# EAGLE design Dashboard r3 (EAGLE 7.7.0)
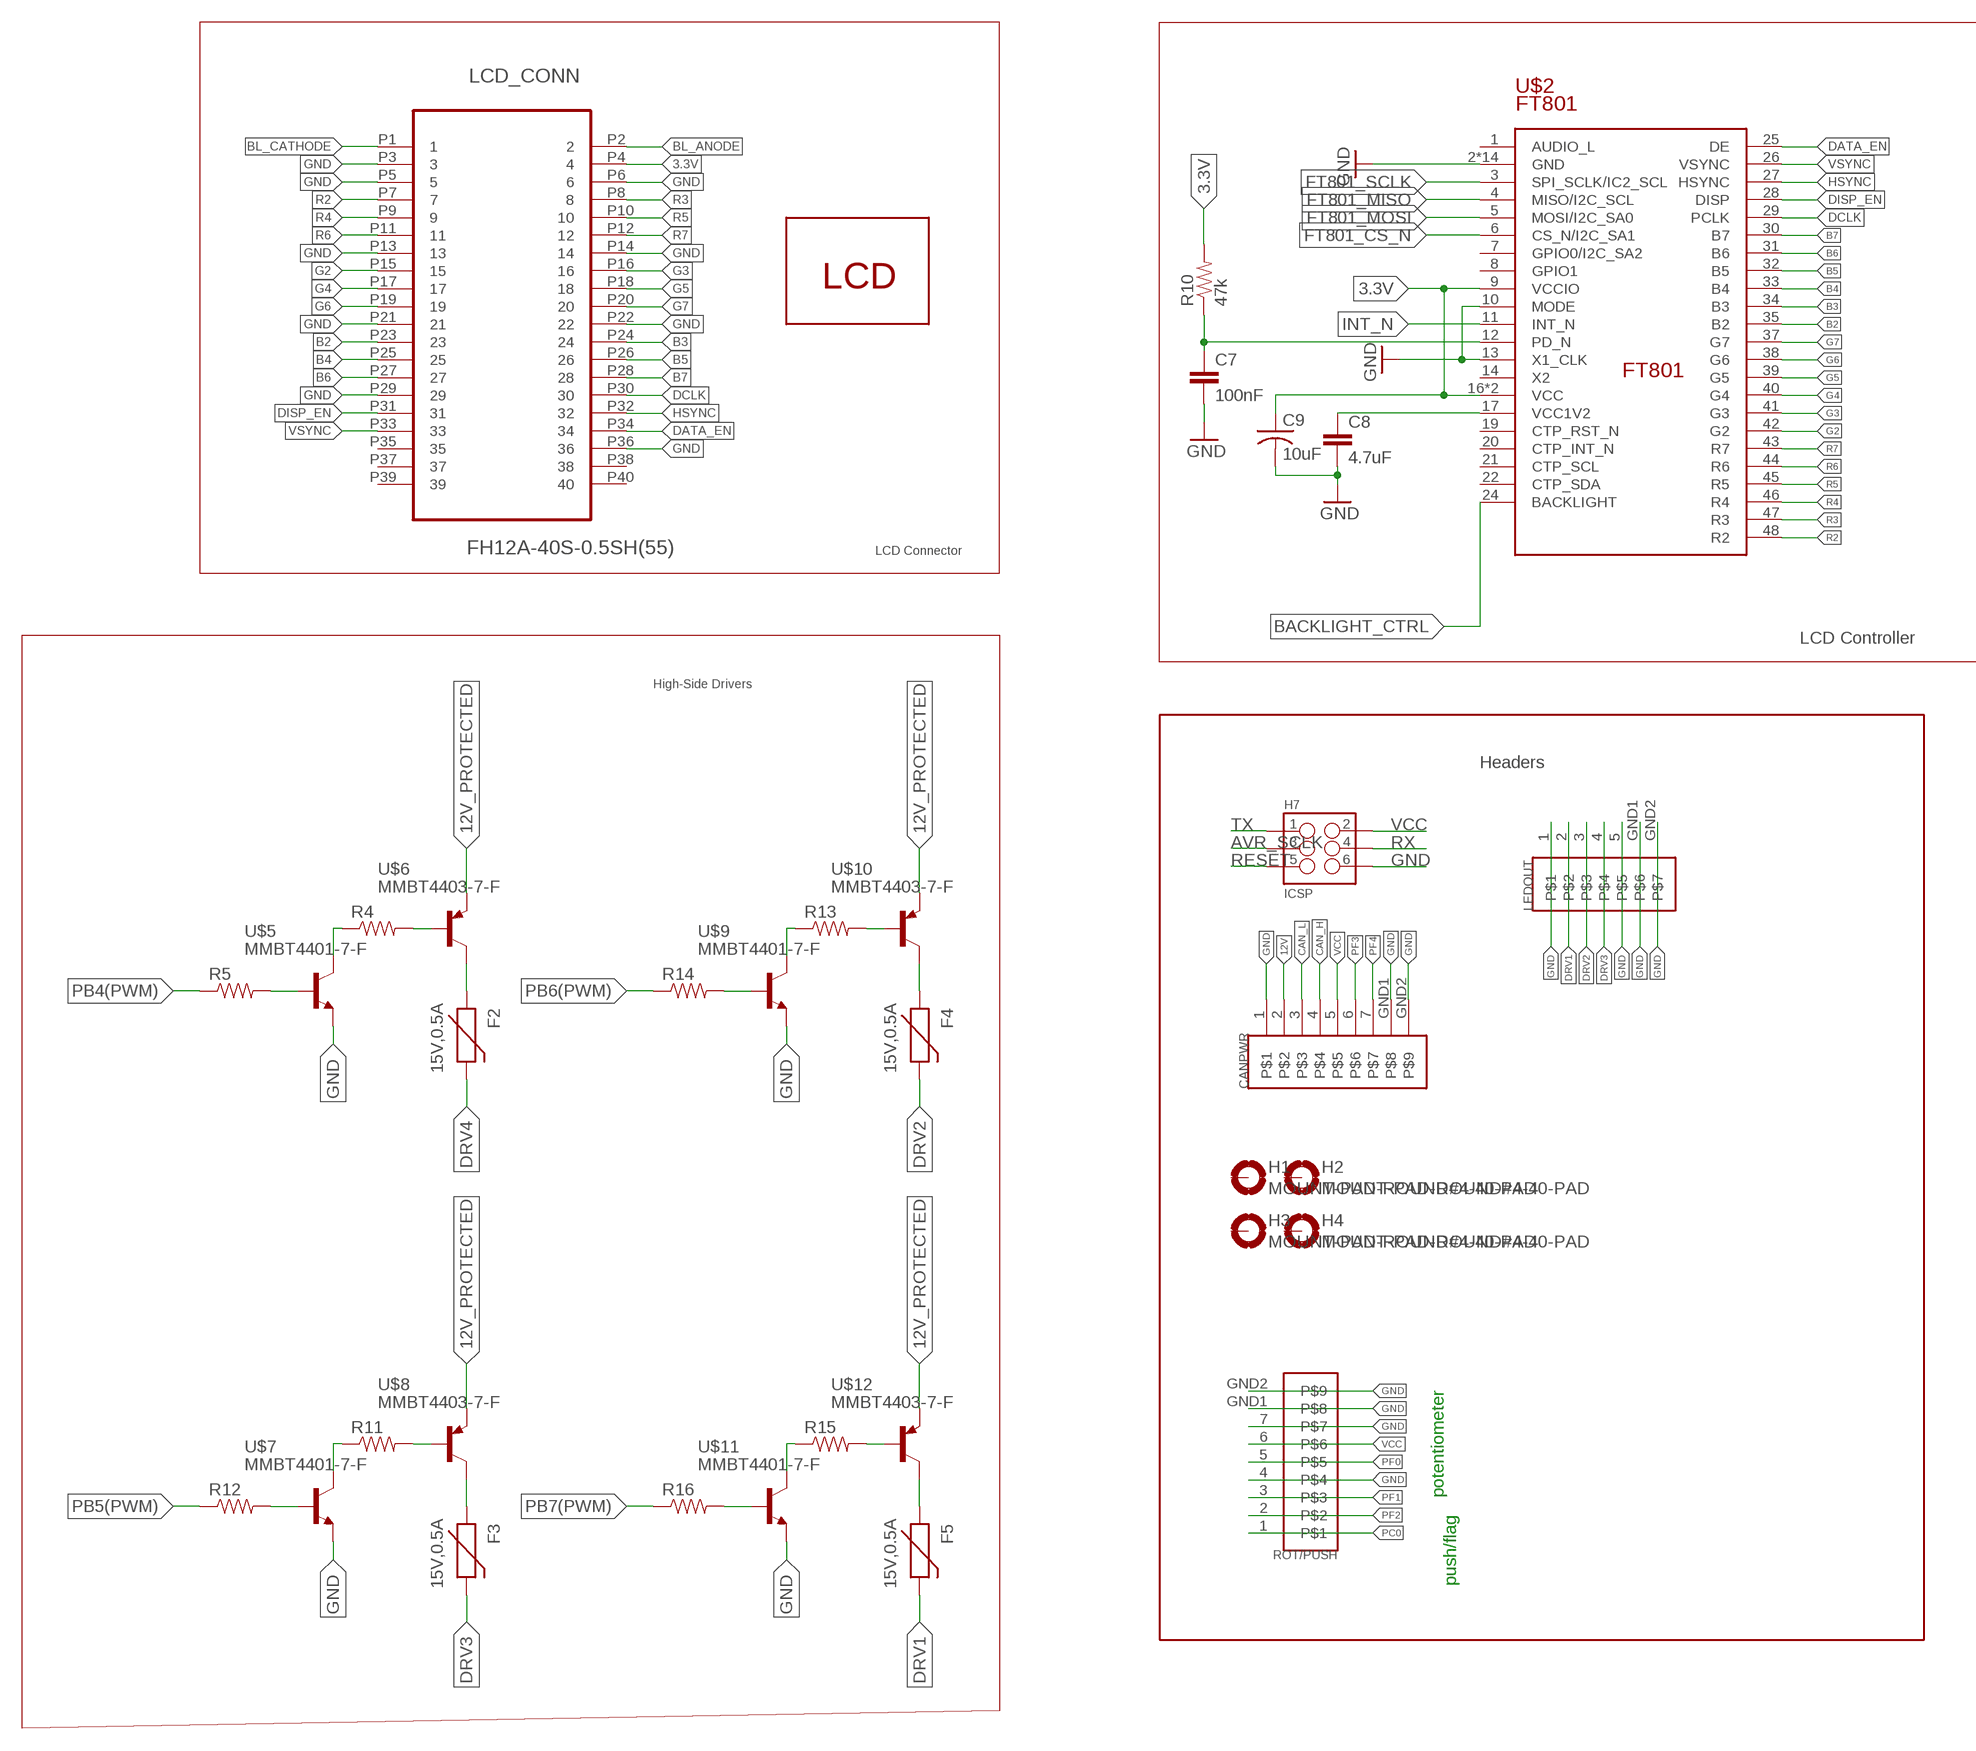
[diagram p0: schematic, sheet 1, part 1 of 2]
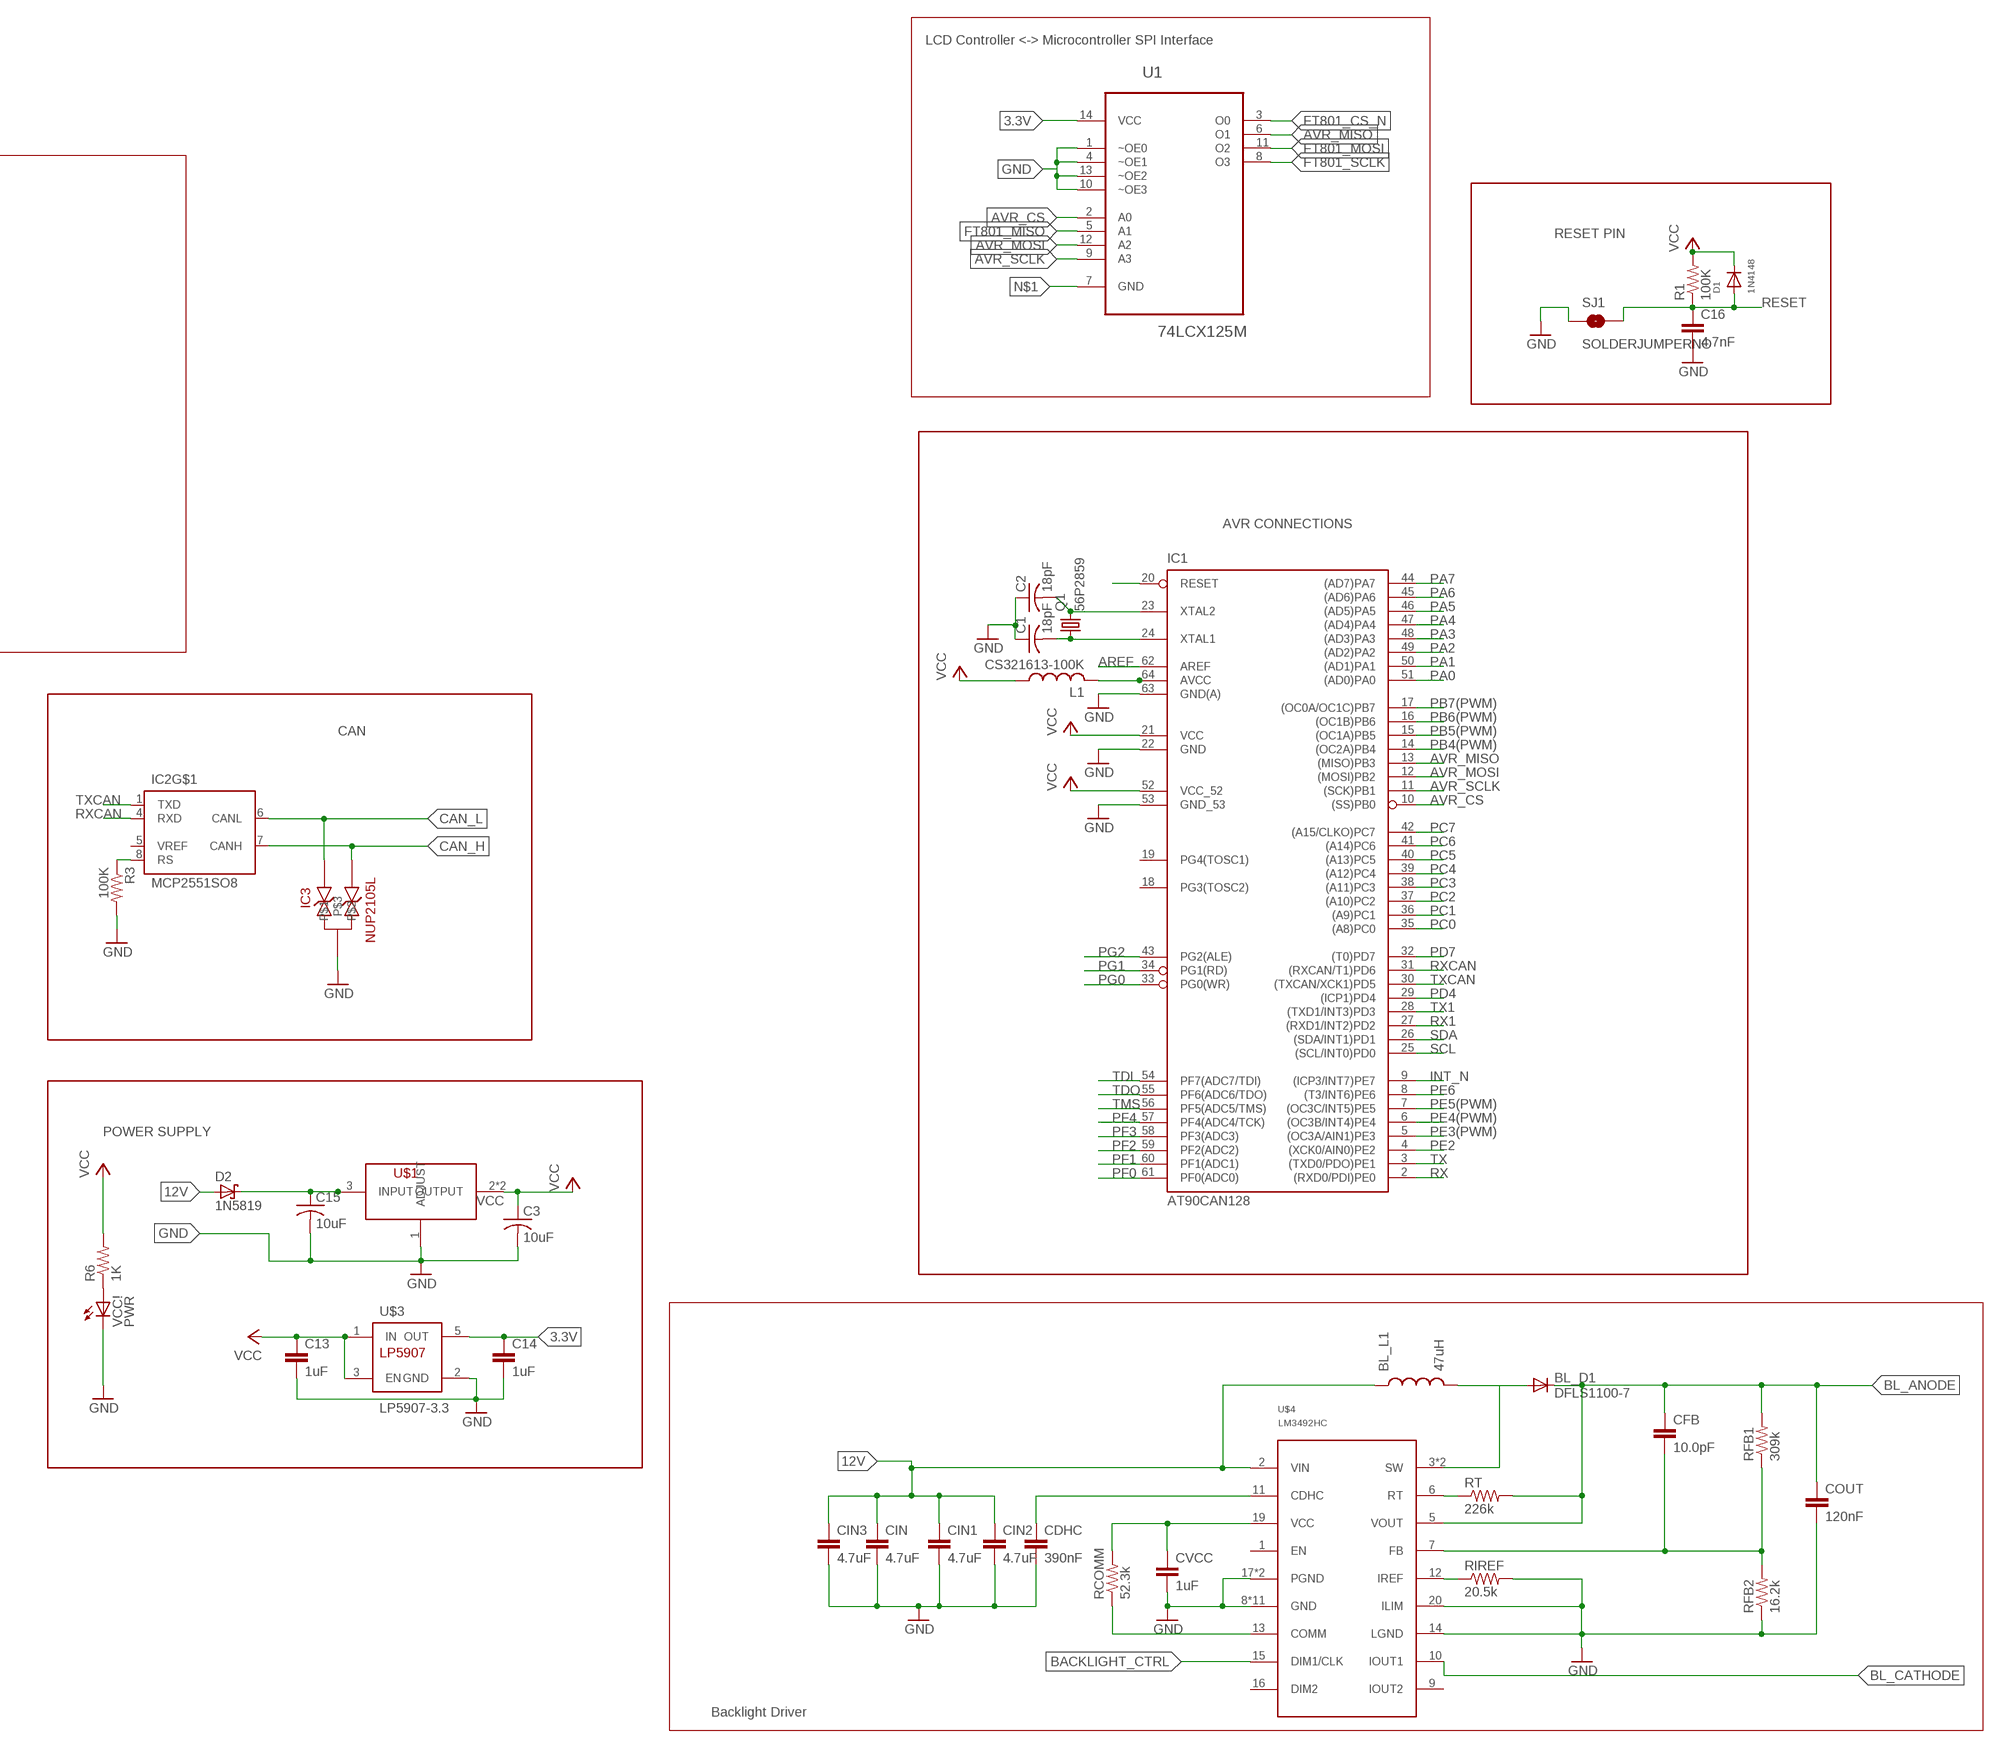
[diagram p1: schematic, sheet 1, part 2 of 2]

## Parts
BL_D1  DFLS1100-7  [POWERDI-123]
BL_L1  47uH  LTF4022-D  [2-SMD]
C1  18pF  C-USC0805  [C0805]
C2  18pF  C-USC0805  [C0805]
C3  10uF  C-USC2220  [C2220]
C7  100nF  CAP0603-CAP  [0603-CAP]
C8  4.7uF  CAP0805  [0805]
C9  10uF  C-USC2220  [C2220]
C13  1uF  CAP0603-CAP  [0603-CAP]
C14  1uF  CAP0603-CAP  [0603-CAP]
C15  10uF  C-USC2220  [C2220]
C16  4.7nF  CAP0805  [0805]
CANPWR  53261-0771  [53261-0771]
CDHC  390nF  CAP0603-CAP  [0603-CAP]
CFB  10.0pF  CAP0603-CAP  [0603-CAP]
CIN  4.7uF  CAP0805  [0805]
CIN1  4.7uF  CAP0805  [0805]
CIN2  4.7uF  CAP0805  [0805]
CIN3  4.7uF  CAP0805  [0805]
COUT  120nF  CAP0805  [0805]
CVCC  1uF  CAP0603-CAP  [0603-CAP]
D1  1N4148  DIODESOD-123  [SOD-123]
D2  1N5819  1N5819-BSOD123  [SOD123]
F2  15V,0.5A  PTCSMD  [PTC-1206]
F3  15V,0.5A  PTCSMD  [PTC-1206]
F4  15V,0.5A  PTCSMD  [PTC-1206]
F5  15V,0.5A  PTCSMD  [PTC-1206]
H1  MOUNT-PAD-ROUND#4-40-PAD  [#4-40-PAD-ROUND]
H2  MOUNT-PAD-ROUND#4-40-PAD  [#4-40-PAD-ROUND]
H3  MOUNT-PAD-ROUND#4-40-PAD  [#4-40-PAD-ROUND]
H4  MOUNT-PAD-ROUND#4-40-PAD  [#4-40-PAD-ROUND]
H7  ICSP  M03X2SMD_FCI  [2X3_SMD_FCI_54202-G30]
IC1  AT90CAN128  [TQFP64]
IC2  MCP2551SO8  [SO08]
IC3  NUP2105L  [SOT-23]
L1  CS321613-100K  L-USL3216C  [L3216C]
LCD_CONN  FH12A-40S-0.5SH(55)  [HIROSE_FH12A-40S-0.5SH(55)]
LEDOUT  53261-0571  [53261-0571]
Q1  56P2859  CRYSTALSMD  [HC49UP]
R1  100K  R-US_R0805  [R0805]
R3  100K  R-US_R0805  [R0805]
R4  RESISTOR0603  [0603-RES]
R5  RESISTOR0603  [0603-RES]
R6  1K  R-US_R0805  [R0805]
R10  47k  RESISTOR0603  [0603-RES]
R11  RESISTOR0603  [0603-RES]
R12  RESISTOR0603  [0603-RES]
R13  RESISTOR0603  [0603-RES]
R14  RESISTOR0603  [0603-RES]
R15  RESISTOR0603  [0603-RES]
R16  RESISTOR0603  [0603-RES]
RCOMM  52.3k  RESISTOR0603  [0603-RES]
RFB1  309k  RESISTOR0603-RES  [0603-RES]
RFB2  16.2k  RESISTOR0603-RES  [0603-RES]
RIREF  20.5k  RESISTOR0603-RES  [0603-RES]
ROT/PUSH  53261-0771  [53261-0771]
RT  226k  RESISTOR0603-RES  [0603-RES]
SJ1  SOLDERJUMPERNO  [SJ_2S-NO]
U1  74LCX125M  [SOIC127P600X175-14N]
U$1  NCP1117  [SOT-223-4]
U$2  FT801  [RGZ48_5P15X5P15]
U$3  LP5907-3.3  LP5907  [SOT23-DBV]
U$4  LM3492HC  [PWP0020A]
U$5  MMBT4401-7-F  [SOT-23-3]
U$6  MMBT4403-7-F  [SOT-23-3]
U$7  MMBT4401-7-F  [SOT-23-3]
U$8  MMBT4403-7-F  [SOT-23-3]
U$9  MMBT4401-7-F  [SOT-23-3]
U$10  MMBT4403-7-F  [SOT-23-3]
U$11  MMBT4401-7-F  [SOT-23-3]
U$12  MMBT4403-7-F  [SOT-23-3]
U$13  TCG043WQLBAANN-GN00  [TCG043WQLBAANN]
VCC!  PWR  LEDCHIPLED_0805  [CHIPLED_0805]

## Nets
3.3V: C9.1 C14.1 LCD_CONN.P4 R10.2 U1.14(VCC) U$2.9(VCCIO) U$2.16(VCC) U$2.18(VCC) U$3.5(OUT)
12V: BL_L1.1 CANPWR.2 CIN1.1 CIN2.1 CIN3.1 CIN.1 D2.A U$4.2(VIN)
12V_PROTECTED [Class3]: C15.1 D2.C U$1.3(INPUT) U$6.P$3(E) U$8.P$3(E) U$10.P$3(E) U$12.P$3(E)
AREF: IC1.62(AREF)
AVR_CS: IC1.10((SS)PB0) U1.2(A0)
AVR_MISO: IC1.13((MISO)PB3) U1.6(O1)
AVR_MOSI: IC1.12((MOSI)PB2) U1.12(A2)
AVR_SCLK: H7.3 IC1.11((SCK)PB1) U1.9(A3)
B2: LCD_CONN.P23 U$2.35(B2)
B3: LCD_CONN.P24 U$2.34(B3)
B4: LCD_CONN.P25 U$2.33(B4)
B5: LCD_CONN.P26 U$2.32(B5)
B6: LCD_CONN.P27 U$2.31(B6)
B7: LCD_CONN.P28 U$2.30(B7)
BACKLIGHT_CTRL: U$2.24(BACKLIGHT) U$4.15(DIM1/CLK)
BL_ANODE: BL_D1.C CFB.1 COUT.1 LCD_CONN.P2 RFB1.2 RT.2 U$4.5(VOUT)
BL_CATHODE: LCD_CONN.P1 U$4.10(IOUT1)
CAN_H: CANPWR.4 IC2.7(CANH) IC3.2
CAN_L: CANPWR.3 IC2.6(CANL) IC3.1
DATA_EN: LCD_CONN.P34 U$2.25(DE)
DCLK: LCD_CONN.P30 U$2.29(PCLK)
DISP_EN: LCD_CONN.P31 U$2.28(DISP)
DRV1: F5.2 LEDOUT.2
DRV2: F4.2 LEDOUT.3
DRV3: F3.2 LEDOUT.4
DRV4 [Class3]: F2.2
FT801_CS_N: U1.3(O0) U$2.6(CS_N/I2C_SA1)
FT801_MISO: U1.5(A1) U$2.4(MISO/I2C_SCL)
FT801_MOSI: U1.11(O2) U$2.5(MOSI/I2C_SA0)
FT801_SCLK: U1.8(O3) U$2.3(SPI_SCLK/IC2_SCL)
G2: LCD_CONN.P15 U$2.42(G2)
G3: LCD_CONN.P16 U$2.41(G3)
G4: LCD_CONN.P17 U$2.40(G4)
G5: LCD_CONN.P18 U$2.39(G5)
G6: LCD_CONN.P19 U$2.38(G6)
G7: LCD_CONN.P20 U$2.37(G7)
GND: C1.1 C2.1 C3.2 C7.2 C8.2 C9.2 C13.2 C14.2 C15.2 C16.2 CANPWR.1 CDHC.2 CIN1.2 CIN2.2 CIN3.2 CIN.2 COUT.2 CVCC.2 H7.6 IC1.22(GND) IC1.53(GND_53) IC1.63(GND(A)) IC3.3 LCD_CONN.P3 LCD_CONN.P5 LCD_CONN.P6 LCD_CONN.P13 LCD_CONN.P14 LCD_CONN.P21 LCD_CONN.P22 LCD_CONN.P29 LCD_CONN.P36 LEDOUT.1 LEDOUT.5 LEDOUT.GND1 LEDOUT.GND2 R3.2 RFB2.1 RIREF.2 ROT/PUSH.4 ROT/PUSH.7 ROT/PUSH.GND1 ROT/PUSH.GND2 SJ1.1 U1.1(~OE0) U1.4(~OE1) U1.10(~OE3) U1.13(~OE2) U$1.1(ADJUST) U$2.2(GND) U$2.10(MODE) U$2.13(X1_CLK) U$2.15(GND) U$2.23(GND) U$2.36(GND) U$2.EP(GND) U$2.V_1(GND) U$2.V_2(GND) U$2.V_3(GND) U$2.V_4(GND) U$2.V_5(GND) U$2.V_6(GND) U$2.V_7(GND) U$2.V_8(GND) U$2.V_9(GND) U$3.2(GND) U$4.8(GND) U$4.14(LGND) U$4.17(PGND) U$4.18(PGND) U$4.20(ILIM) U$4.EP(GND) U$4.P$1(GND) U$4.P$2(GND) U$4.P$3(GND) U$4.P$4(GND) U$4.P$5(GND) U$4.P$6(GND) U$4.P$7(GND) U$4.P$8(GND) U$4.P$9(GND) U$5.P$3(E) U$7.P$3(E) U$9.P$3(E) U$11.P$3(E) VCC!.C
HSYNC: LCD_CONN.P32 U$2.27(HSYNC)
INT_N: IC1.9((ICP3/INT7)PE7) U$2.11(INT_N)
N$1 [Class2]: U1.7(GND)
N$2: C8.1 U$2.17(VCC1V2)
N$3: C7.1 R10.1 U$2.12(PD_N)
N$4: CVCC.1 RCOMM.2 U$4.19(VCC)
N$5: RCOMM.1 U$4.13(COMM)
N$6: IC2.8(RS) R3.1
N$7: CDHC.1 U$4.11(CDHC)
N$8: BL_D1.A BL_L1.2 U$4.3(SW) U$4.4(SW)
N$9: R6.1 VCC!.A
N$10: CFB.2 RFB1.1 RFB2.2 U$4.7(FB)
N$11: C1.2 IC1.24(XTAL1) Q1.1
N$12: RT.1 U$4.6(RT)
N$14: RIREF.1 U$4.12(IREF)
N$22: IC1.64(AVCC) L1.2
N$23: R5.2 U$5.P$2(B)
N$24 [Class3]: R4.2 U$6.P$2(B)
N$25: R4.1 U$5.P$1(C)
N$26 [Class3]: F2.1 U$6.P$1(C)
N$27: R12.2 U$7.P$2(B)
N$28 [Class3]: R11.2 U$8.P$2(B)
N$29 [Class3]: R11.1 U$7.P$1(C)
N$30: F3.1 U$8.P$1(C)
N$31: R14.2 U$9.P$2(B)
N$33: R13.2 U$10.P$2(B)
N$37 [Class3]: R13.1 U$9.P$1(C)
N$38: F4.1 U$10.P$1(C)
N$39: R16.2 U$11.P$2(B)
N$40 [Class3]: R15.2 U$12.P$2(B)
N$41 [Class3]: R15.1 U$11.P$1(C)
N$42: F5.1 U$12.P$1(C)
PA0: IC1.51((AD0)PA0)
PA1: IC1.50((AD1)PA1)
PA2: IC1.49((AD2)PA2)
PA3: IC1.48((AD3)PA3)
PA4: IC1.47((AD4)PA4)
PA5: IC1.46((AD5)PA5)
PA6: IC1.45((AD6)PA6)
PA7: IC1.44((AD7)PA7)
PB4(PWM): IC1.14((OC2A)PB4) R5.1
PB5(PWM): IC1.15((OC1A)PB5) R12.1
PB6(PWM): IC1.16((OC1B)PB6) R14.1
PB7(PWM): IC1.17((OC0A/OC1C)PB7) R16.1
PC0: IC1.35((A8)PC0) ROT/PUSH.1
PC1: IC1.36((A9)PC1)
PC2: IC1.37((A10)PC2)
PC3: IC1.38((A11)PC3)
PC4: IC1.39((A12)PC4)
PC5: IC1.40((A13)PC5)
PC6: IC1.41((A14)PC6)
PC7: IC1.42((A15/CLKO)PC7)
PD4: IC1.29((ICP1)PD4)
PD7: IC1.32((T0)PD7)
PE2: IC1.4((XCK0/AIN0)PE2)
PE3(PWM): IC1.5((OC3A/AIN1)PE3)
PE4(PWM): IC1.6((OC3B/INT4)PE4)
PE5(PWM): IC1.7((OC3C/INT5)PE5)
PE6: IC1.8((T3/INT6)PE6)
PF0: IC1.61(PF0(ADC0)) ROT/PUSH.5
PF1: IC1.60(PF1(ADC1)) ROT/PUSH.3
PF2: IC1.59(PF2(ADC2)) ROT/PUSH.2
PF3: CANPWR.6 IC1.58(PF3(ADC3))
PF4: CANPWR.7 IC1.57(PF4(ADC4/TCK))
PG0: IC1.33(PG0(WR))
PG1: IC1.34(PG1(RD))
PG2: IC1.43(PG2(ALE))
R2: LCD_CONN.P7 U$2.48(R2)
R3: LCD_CONN.P8 U$2.47(R3)
R4: LCD_CONN.P9 U$2.46(R4)
R5: LCD_CONN.P10 U$2.45(R5)
R6: LCD_CONN.P11 U$2.44(R6)
R7: LCD_CONN.P12 U$2.43(R7)
RESET [Class1]: C16.1 D1.A H7.5 IC1.20(RESET) R1.1 SJ1.2
RX: H7.4 IC1.2((RXD0/PDI)PE0)
RX1: IC1.27((RXD1/INT2)PD2)
RXCAN: IC1.31((RXCAN/T1)PD6) IC2.4(RXD)
SCL: IC1.25((SCL/INT0)PD0)
SDA: IC1.26((SDA/INT1)PD1)
TDI: IC1.54(PF7(ADC7/TDI))
TDO: IC1.55(PF6(ADC6/TDO))
TMS: IC1.56(PF5(ADC5/TMS))
TX: H7.1 IC1.3((TXD0/PDO)PE1)
TX1: IC1.28((TXD1/INT3)PD3)
TXCAN: IC1.30((TXCAN/XCK1)PD5) IC2.1(TXD)
VCC: C3.1 C13.1 CANPWR.5 D1.C H7.2 IC1.21(VCC) IC1.52(VCC_52) L1.1 R1.2 R6.2 ROT/PUSH.6 U$1.2(OUTPUT) U$1.4(OUTPUT) U$3.1(IN) U$3.3(EN)
VSYNC: LCD_CONN.P33 U$2.26(VSYNC)
XTAL1: C2.2 IC1.23(XTAL2) Q1.2
Unconnected: CANPWR.GND1 CANPWR.GND2 H1.P$1(MOUNT) H2.P$1(MOUNT) H3.P$1(MOUNT) H4.P$1(MOUNT) IC1.18(PG3(TOSC2)) IC1.19(PG4(TOSC1)) IC2.5(VREF) LCD_CONN.P35 LCD_CONN.P37 LCD_CONN.P38 LCD_CONN.P39 LCD_CONN.P40 U$2.1(AUDIO_L) U$2.7(GPIO0/I2C_SA2) U$2.8(GPIO1) U$2.14(X2) U$2.19(CTP_RST_N) U$2.20(CTP_INT_N) U$2.21(CTP_SCL) U$2.22(CTP_SDA) U$4.1(EN) U$4.9(IOUT2) U$4.16(DIM2)

## Notes on the sheet
- LCD Controller <-> Microcontroller SPI Interface
- RESET PIN
- AVR CONNECTIONS
- LCD Connector
- LCD Controller
- High-Side Drivers
- Headers | CAN
- POWER SUPPLY
- potentiometer
- push/flag
- Backlight Driver

## Power pins joined to a net without a drawn wire
GND: IC2.2(GND)
VCC: IC2.3(VCC)

## Library data of the parts
BL_D1 = diodes-inc:DFLS1100-7
BL_L1 = tdk:LTF4022-D: LTF4022
C1 C2 = rcl:C-US: CAPACITOR, American symbol
C3 C9 C15 = resistor:C-US: CAPACITOR, American symbol
C7 C8 C13 C14 C16 CDHC CIN CIN1-CIN3 CVCC = SparkFun-Capacitors:CAP: Capacitor Standard 0603 ceramic capacitor, and 0.1" leaded capacitor.
CANPWR ROT/PUSH = molex:53261-0771
CFB COUT = SparkFun-Passives:CAP: Capacitor Standard 0603 ceramic capacitor, and 0.1" leaded capacitor.
D1 = adafruit:DIODE: Diode SMADIODE - SMA Surface Mount Package 20V 1A Schottky Diode Digikey: 641-1014-6-ND DO-1N4148 - Through Hole Small Current Diode SOD-123 20V 1 A (.5mV Vf) Schottky Diode - Digikey: MBRX120TPMSCT-ND SOD-323 10V 570mA (.38mV Vf, 3ns) Schottky Diode - Digikey: ZLLS410CT-ND SOD-523 30V 30mA Schottky Diode (RB751S-40TE61) - Digikey: RB751S-40TE61CT-ND SOT23-R/W - SOT23 Package (R = Solder Paste/Reflow Ovens, W = Hand-Soldering) BAT54Film 40V 300mA - Digikey: 497-7162-1-ND
D2 = diode:1N581*: 1.0A SCHOTTKY BARRIER RECTIFIER Source: http://www.diodes.com/datasheets/ds23001.pdf
F2-F5 = SparkFun:PTC: Resettable Fuse PTC Resettable Fuse. Spark Fun Electronics SKU : COM-08357
H1-H4 = holes:MOUNT-PAD-ROUND: MOUNTING PAD, round
H7 = SparkFun-Connectors:M03X2: 2x3 .1" header. Shrouded, with keying- CONN-10681 SMT- CONN-11415 Pogo pins- HW-11044
IC1 = at90can128:AT90CAN128
IC2 = can:MCP2551: CAN Tranceiver Microchip
IC3 = Artificial Science:NUP2105L
L1 = rcl:L-US: INDUCTOR, American symbol
LCD_CONN = hirose:FH12A-40S-0.5SH(55): SOCKET FFC/FPC, ZIF, 0.5MM, 40WAY; MPN: FH12A-40S-0.5SH(55); OC_FARNELL: 1324569; OC_NEWARK: 34M6194; PACKAGE: SOCKET FFC/FPC, ZIF, 0.5MM, 40WAY; SUPPLIER: Hirose
LEDOUT = molex:53261-0571
Q1 = SparkFun-FreqCtrl:CRYSTAL: Various standard crystals. Proven footprints. Spark Fun Electronics SKU : COM-00534
R1 R3 R6 = rcl:R-US_: RESISTOR, American symbol
R4 R5 R10-R16 RCOMM = SparkFun-Resistors:RESISTOR: Resistor Basic schematic elements and footprints for 0603, 1206, and PTH resistors.
RFB1 RFB2 RIREF RT = SparkFun-Passives:RESISTOR: Resistor Basic schematic elements and footprints for 0603, 1206, and PTH resistors.
SJ1 = SparkFun-Passives:SOLDERJUMPER: Solder Jumper Standard SMD solder jumper. Used to automate production. Two varients : Normally Open and Normally Closed are the same, but have different paste layers. NC will have a large amount of paste and should jumper during reflow.
U1 = Fairchild_By_element14_Batch_1:74LCX125M: Low Voltage Quad Buffer with 5V Tolerant Inputs and Outputs; MPN: 74LCX125M; OC_FARNELL: 1013776; OC_NEWARK: 78K6286; PACKAGE: SOIC-14; SUPPLIER: Fairchild
U$1 = on-semiconductor:NCP1117
U$2 = ftdichip:FT801: IC TFT LCD CONTROLLER 48VQFN
U$3 = texas:LP5907
U$4 = texas:LM3492HC
U$5 U$7 U$9 U$11 = formula electric:MMBT4401-7-F
U$6 U$8 U$10 U$12 = formula electric:MMBT4403-7-F
U$13 = kyocera:TCG043WQLBAANN-GN00
VCC! = led:LED: LED OSRAM: - CHIPLED LG R971, LG N971, LY N971, LG Q971, LY Q971, LO R971, LY R971 LH N974, LH R974 LS Q976, LO Q976, LY Q976 LO Q996 - Hyper CHIPLED LW Q18S LB Q993, LB Q99A, LB R99A - SideLED LS A670, LO A670, LY A670, LG A670, LP A670 LB A673, LV A673, LT A673, LW A673 LH A674 LY A675 LS A676, LA A676, LO A676, LY A676, LW A676 LS A679, LY A679, LG A679 - Hyper Micro SIDELED® LS Y876, LA Y876, LO Y876, LY Y876 LT Y87S - SmartLED LW L88C, LW L88S LB L89C, LB L89S, LG L890 LS L89K, LO L89K, LY L89K LS L896, LA L896, LO L896, LY L896 - TOPLED LS T670, LO T670, LY T670, LG T670, LP T670 LSG T670, LSP T670, LSY T670, LOP T670, LYG T670 LG T671, LOG T671, LSG T671 LB T673, LV T673, LT T673, LW T673 LH T674 LS T676, LA T676, LO T676, LY T676, LB T676, LH T676, LSB T676, LW T676 LB T67C, LV T67C, LT T67C, LS T67K, LO T67K, LY T67K, LW E67C LS E67B, LA E67B, LO E67B, LY E67B, LB E67C, LV E67C, LT E67C LW T67C LS T679, LY T679, LG T679 LS T770, LO T770, LY T770, LG T770, LP T770 LB T773, LV T773, LT T773, LW T773 LH T774 LS E675, LA E675, LY E675, LS T675 LS T776, LA T776, LO T776, LY T776, LB T776 LHGB T686 LT T68C, LB T68C - Hyper Mini TOPLED® LB M676 - Mini TOPLED Santana® LG M470 LS M47K, LO M47K, LY M47K Source: http://www.osram.convergy.de LUXEON: - LUMILED® LXK2-PW12-R00, LXK2-PW12-S00, LXK2-PW14-U00, LXK2-PW14-V00 LXK2-PM12-R00, LXK2-PM12-S00, LXK2-PM14-U00 LXK2-PE12-Q00, LXK2-PE12-R00, LXK2-PE12-S00, LXK2-PE14-T00, LXK2-PE14-U00 LXK2-PB12-K00, LXK2-PB12-L00, LXK2-PB12-M00, LXK2-PB14-N00, LXK2-PB14-P00, LXK2-PB14-Q00 LXK2-PR12-L00, LXK2-PR12-M00, LXK2-PR14-Q00, LXK2-PR14-R00 LXK2-PD12-Q00, LXK2-PD12-R00, LXK2-PD12-S00 LXK2-PH12-R00, LXK2-PH12-S00 LXK2-PL12-P00, LXK2-PL12-Q00, LXK2-PL12-R00 Source: www.luxeon.com KINGBRIGHT: KA-3528ASYC Source: www.kingbright.com

## Net classes
0 default: width 0.254 mm, clearance 0.178 mm
1 Class1: width 0.508 mm, clearance 0.178 mm
2 Class2: width 0.635 mm, clearance 0.178 mm
3 Class3: width 0.559 mm
4 GND: width 0.406 mm

## Board
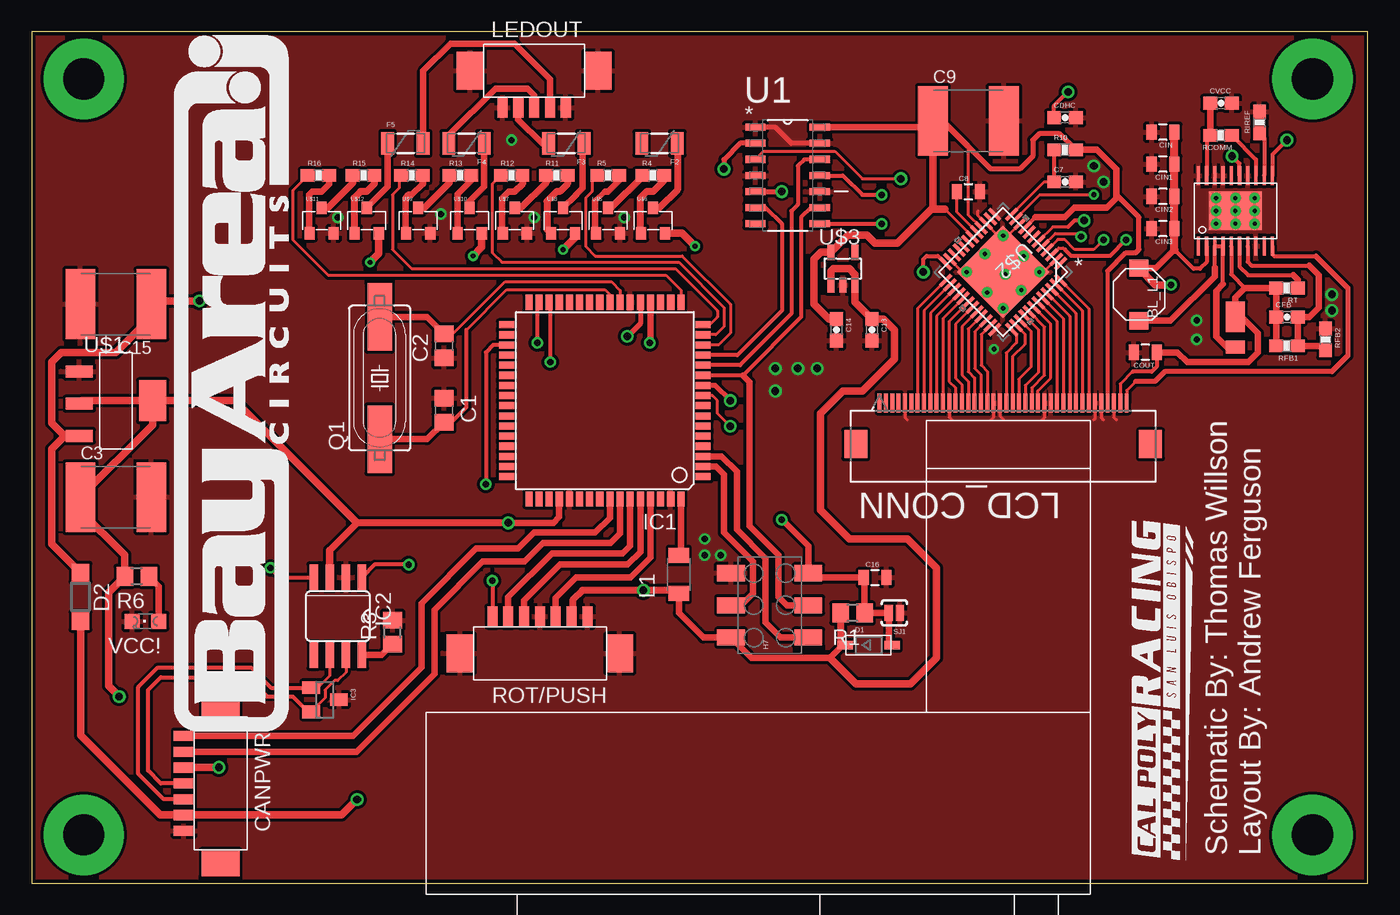
[diagram p2: board, top side]
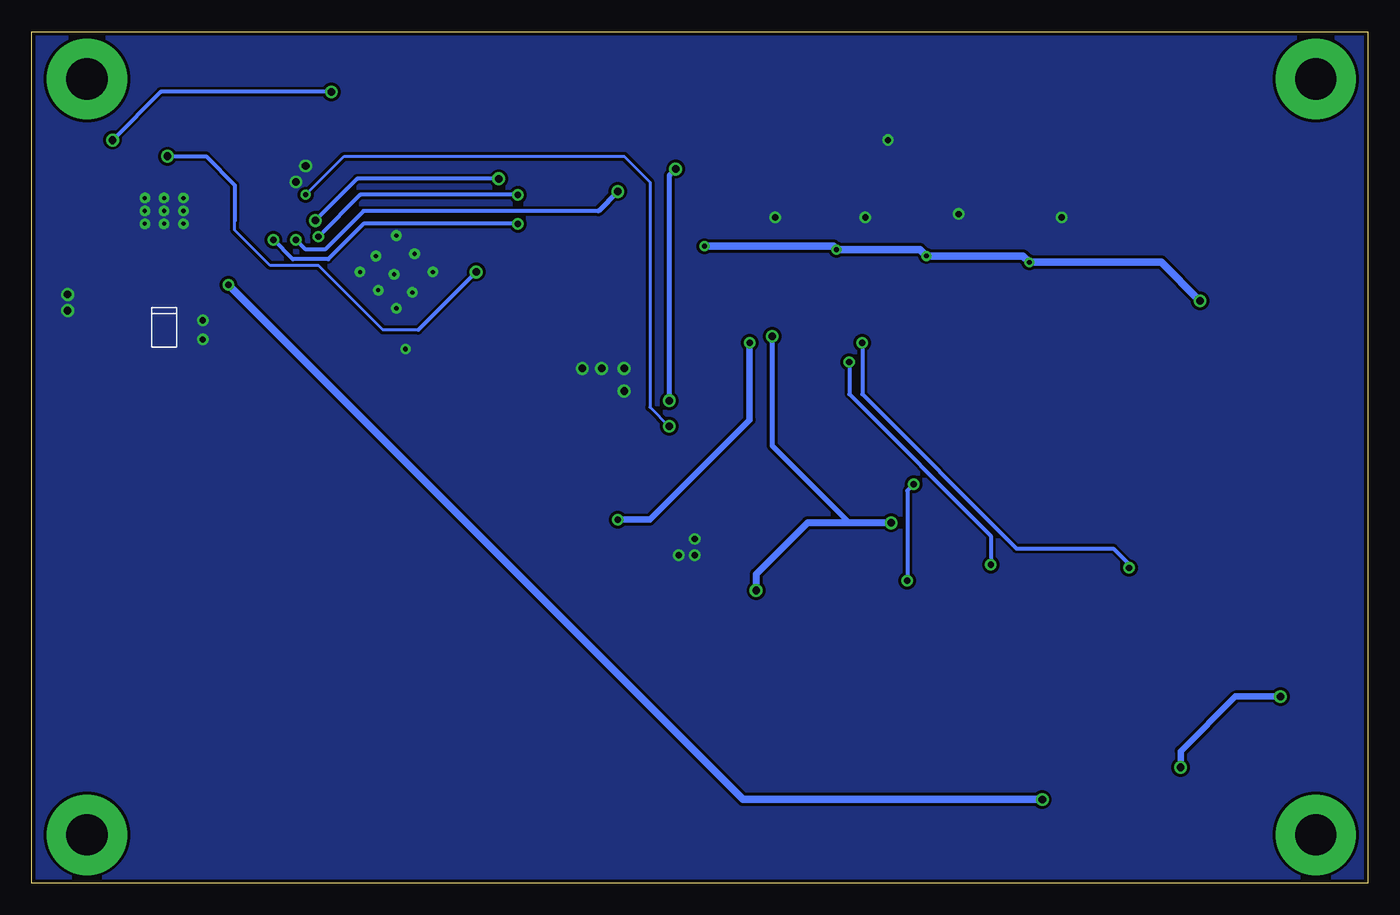
[diagram p3: board, bottom side, seen from below]

Size 105.5 x 67.24 mm. Coordinates in mm from the lower left corner, seen from the top.
Outline: 0,0 105.5,0 105.5,67.24 0,67.24 0,0
Copper layers (1*16): Top 0.035mm / dielectric 1.5mm / Bottom 0.035mm
Design rules "default *": minimum track width 7mil, minimum drill 8mil, track to track 9mil, track to pad 9mil, pad to pad 9mil, via to via 9mil, smd to smd 8mil, copper to edge 12mil, drill to drill 12mil, minimum pad ring 10mil, minimum via ring 8mil, stop-mask expansion 4mil, vias tented up to drill 0mil, thermal gap 10mil

### Footprints (pad centres in the part's own frame; a part is rotated, then mirrored left to right if it is on the bottom)
POWERDI-123 = smd 1.05 x 1.5: A -0.85,0 | smd 2.4 x 1.5: C 1.525,0
2-SMD = smd 1.35 x 1.5: 1 -2.075,0; 2 2.075,0
C0805 = smd 1.3 x 1.5: 1 -0.95,0; 2 0.95,0
C2220 = smd 2.35 x 5.5: 1 -2.8,0; 2 2.8,0
0603-CAP = smd 1.1 x 1: 1 -0.85,0; 2 0.85,0
0805 = smd 0.8 x 1.2: 1 -0.9,0; 2 0.9,0
53261-0771 = smd 0.8 x 1.6: 1 -3.75,-0.8; 2 -2.5,-0.8; 3 -1.25,-0.8; 4 0,-0.8; 5 1.25,-0.8; 6 2.5,-0.8; 7 3.75,-0.8 | smd 2.1 x 3: GND1 -6.3,-3.7; GND2 6.3,-3.7
SOD-123 = smd 1.2 x 0.7: A 1.85,0; C -1.85,0
SOD123 = smd 1.4 x 1.4: A 1.9,0; C -1.9,0
PTC-1206 = smd 1 x 1.8: 1 -1.4,0; 2 1.4,0
#4-40-PAD-ROUND = drill 3.264 pad 6.35: P$1 0,0
2X3_SMD_FCI_54202-G30 = smd 1.27 x 2.18: 1 -2.54,-3.05; 2 -2.54,3.05; 3 0,-3.05; 4 0,3.05; 5 2.54,-3.05; 6 2.54,3.05
TQFP64 = smd 1.194 x 0.559: 1 -7.76,6; 2 -7.76,5.2; 3 -7.76,4.4; 4 -7.76,3.6; 5 -7.76,2.8; 6 -7.76,2; 7 -7.76,1.2; 8 -7.76,0.4; 9 -7.76,-0.4; 10 -7.76,-1.2; 11 -7.76,-2; 12 -7.76,-2.8; 13 -7.76,-3.6; 14 -7.76,-4.4; 15 -7.76,-5.2; 16 -7.76,-6; 33 7.76,-6; 34 7.76,-5.2; 35 7.76,-4.4; 36 7.76,-3.6; 37 7.76,-2.8; 38 7.76,-2; 39 7.76,-1.2; 40 7.76,-0.4; 41 7.76,0.4; 42 7.76,1.2; 43 7.76,2; 44 7.76,2.8; 45 7.76,3.6; 46 7.76,4.4; 47 7.76,5.2; 48 7.76,6 | smd 0.559 x 1.194: 17 -6,-7.76; 18 -5.2,-7.76; 19 -4.4,-7.76; 20 -3.6,-7.76; 21 -2.8,-7.76; 22 -2,-7.76; 23 -1.2,-7.76; 24 -0.4,-7.76; 25 0.4,-7.76; 26 1.2,-7.76; 27 2,-7.76; 28 2.8,-7.76; 29 3.6,-7.76; 30 4.4,-7.76; 31 5.2,-7.76; 32 6,-7.76; 49 6,7.76; 50 5.2,7.76; 51 4.4,7.76; 52 3.6,7.76; 53 2.8,7.76; 54 2,7.76; 55 1.2,7.76; 56 0.4,7.76; 57 -0.4,7.76; 58 -1.2,7.76; 59 -2,7.76; 60 -2.8,7.76; 61 -3.6,7.76; 62 -4.4,7.76; 63 -5.2,7.76; 64 -6,7.76
SO08 = smd 0.66 x 2.032: 1 -1.905,-3.073; 2 -0.635,-3.073; 3 0.635,-3.073; 4 1.905,-3.073; 5 1.905,3.073; 6 0.635,3.073; 7 -0.635,3.073; 8 -1.905,3.073
SOT-23 = smd 1 x 1.4: 1 -0.95,-1.1; 2 0.95,-1.1; 3 0,1.1
L3216C = smd 1.2 x 1.6: 1 -1.5,0; 2 1.5,0
HIROSE_FH12A-40S-0.5SH(55) = smd 1.803 x 2.21: 41 -11.633,6.68; 42 11.633,6.68 | smd 0.305 x 1.499: P1 -9.754,3.429; P2 -9.246,3.429; P3 -8.738,3.429; P4 -8.255,3.429; P5 -7.747,3.429; P6 -7.239,3.429; P7 -6.756,3.429; P8 -6.248,3.429; P9 -5.74,3.429; P10 -5.258,3.429; P11 -4.75,3.429; P12 -4.242,3.429; P13 -3.759,3.429; P14 -3.251,3.429; P15 -2.743,3.429; P16 -2.261,3.429; P17 -1.753,3.429; P18 -1.245,3.429; P19 -0.762,3.429; P20 -0.254,3.429; P21 0.254,3.429; P22 0.762,3.429; P23 1.245,3.429; P24 1.753,3.429; P25 2.261,3.429; P26 2.743,3.429; P27 3.251,3.429; P28 3.759,3.429; P29 4.242,3.429; P30 4.75,3.429; P31 5.258,3.429; P32 5.74,3.429; P33 6.248,3.429; P34 6.756,3.429; P35 7.239,3.429; P36 7.747,3.429; P37 8.255,3.429; P38 8.738,3.429; P39 9.246,3.429; P40 9.754,3.429
53261-0571 = smd 0.8 x 1.6: 1 -2.5,-0.8; 2 -1.25,-0.8; 3 0,-0.8; 4 1.25,-0.8; 5 2.5,-0.8 | smd 2.1 x 3: GND1 -5.05,-3.7; GND2 5.05,-3.7
HC49UP = smd 5.334 x 1.93: 1 -4.826,0; 2 4.826,0
R0805 = smd 1.3 x 1.5: 1 -0.95,0; 2 0.95,0
0603-RES = smd 1.1 x 1: 1 -0.85,0; 2 0.85,0
SJ_2S-NO = smd 0.635 x 1.27: 1 -0.45,0; 2 0.45,0
SOIC127P600X175-14N = smd 1.6 x 0.559: 1 -2.54,3.81; 2 -2.54,2.54; 3 -2.54,1.27; 4 -2.54,0; 5 -2.54,-1.27; 6 -2.54,-2.54; 7 -2.54,-3.81; 8 2.54,-3.81; 9 2.54,-2.54; 10 2.54,-1.27; 11 2.54,0; 12 2.54,1.27; 13 2.54,2.54; 14 2.54,3.81
SOT-223-4 = smd 0.95 x 2.15: 1 -2.3,-2.9; 2 0.24,-2.9; 3 2.78,-2.9 | smd 3.25 x 2.15: 4 0,2.9
RGZ48_5P15X5P15 = smd 1.245 x 0.279: 1 -3.683,2.743; 2 -3.683,2.261; 3 -3.683,1.753; 4 -3.683,1.245; 5 -3.683,0.762; 6 -3.683,0.254; 7 -3.683,-0.254; 8 -3.683,-0.762; 9 -3.683,-1.245; 10 -3.683,-1.753; 11 -3.683,-2.261; 12 -3.683,-2.743; 25 3.683,-2.743; 26 3.683,-2.261; 27 3.683,-1.753; 28 3.683,-1.245; 29 3.683,-0.762; 30 3.683,-0.254; 31 3.683,0.254; 32 3.683,0.762; 33 3.683,1.245; 34 3.683,1.753; 35 3.683,2.261; 36 3.683,2.743 | smd 0.279 x 1.245: 13 -2.743,-3.683; 14 -2.261,-3.683; 15 -1.753,-3.683; 16 -1.245,-3.683; 17 -0.762,-3.683; 18 -0.254,-3.683; 19 0.254,-3.683; 20 0.762,-3.683; 21 1.245,-3.683; 22 1.753,-3.683; 23 2.261,-3.683; 24 2.743,-3.683; 37 2.743,3.683; 38 2.261,3.683; 39 1.753,3.683; 40 1.245,3.683; 41 0.762,3.683; 42 0.254,3.683; 43 -0.254,3.683; 44 -0.762,3.683; 45 -1.245,3.683; 46 -1.753,3.683; 47 -2.261,3.683; 48 -2.743,3.683 | smd 5.156 x 5.156: EP 0,0 | drill 0.33: V_1 -2.032,2.032; V_2 0,2.032; V_3 2.032,2.032; V_4 -2.032,0.254; V_5 0,0.254; V_6 2.032,0.254; V_7 -2.032,-2.032; V_8 0,-2.032; V_9 2.032,-2.032
SOT23-DBV = smd 0.55 x 1.2: 1 -0.95,-1.3; 2 0,-1.3; 3 0.95,-1.3; 4 0.95,1.3; 5 -0.95,1.3
PWP0020A = smd 0.25 x 1.5: 1 -2.925,-2.8; 2 -2.275,-2.8; 3 -1.625,-2.8; 4 -0.975,-2.8; 5 -0.325,-2.8; 6 0.325,-2.8; 7 0.975,-2.8; 8 1.625,-2.8; 9 2.275,-2.8; 10 2.925,-2.8; 11 2.925,2.8; 12 2.275,2.8; 13 1.625,2.8; 14 0.975,2.8; 15 0.325,2.8; 16 -0.325,2.8; 17 -0.975,2.8; 18 -1.625,2.8; 19 -2.275,2.8; 20 -2.925,2.8 | smd 4.2 x 3: EP 0,0 | drill 0.33: P$1 -1.524,1.016; P$2 0,1.016; P$3 1.524,1.016; P$4 -1.524,0; P$5 0,0; P$6 1.524,0; P$7 1.524,-1.016; P$8 0,-1.016; P$9 -1.524,-1.016
SOT-23-3 = smd 0.8 x 0.976: P$1 0,1; P$2 -0.95,-1; P$3 0.95,-1
CHIPLED_0805 = smd 1.2 x 1.2: A 0,-1.05; C 0,1.05

### Placement (x,y rotation side)
BL_D1  95.04,43.18 90 top
BL_L1  87.42,46.48 270 top
C1  32.56,37.34 270 top
C2  32.56,42.42 90 top
C3  6.65,30.48 0 top
C7  81.58,55.37 0 top
C8  73.96,54.61 0 top
C9  73.96,60.2 0 top
C13  66.34,43.69 270 top
C14  63.55,43.69 270 top
C15  6.65,45.72 180 top
C16  66.59,24.13 0 top
CANPWR  11.22,7.87 90 top
CDHC  81.58,60.45 0 top
CFB  99.11,44.7 0 top
CIN  89.33,59.31 180 top
CIN1  89.33,56.77 180 top
CIN2  89.33,54.23 180 top
CIN3  89.33,51.69 180 top
COUT  87.93,41.91 180 top
CVCC  93.9,61.59 0 top
D1  66.09,18.8 0 top
D2  3.86,22.61 270 top
F2  49.58,58.42 180 top
F3  42.21,58.42 180 top
F4  34.34,58.42 180 top
F5  29.51,58.42 0 top
H1  4.11,3.81 0 top
H2  101.14,3.81 0 top
H3  4.11,63.5 0 top
H4  101.14,63.5 0 top
H7  58.27,21.94 90 top
IC1  45.26,38.1 180 top
IC2  24.18,21.08 180 top
IC3  23.16,14.48 270 top
L1  51.1,24.38 90 top
LCD_CONN  76.7,41.35 180 top
LEDOUT  39.67,60.45 180 top
Q1  27.48,39.88 90 top
R1  64.82,21.34 180 top
R3  28.49,19.81 90 top
R4  49.07,55.88 0 top
R5  45.51,55.88 0 top
R6  8.3,24.23 180 top
R10  81.58,57.91 0 top
R11  41.45,55.88 0 top
R12  37.89,55.88 0 top
R13  33.83,55.88 0 top
R14  30.02,55.88 0 top
R15  26.21,55.88 0 top
R16  22.65,55.88 0 top
RCOMM  93.9,59.05 180 top
RFB1  99.11,42.42 180 top
RFB2  102.15,42.93 270 top
RIREF  96.95,60.07 90 top
ROT/PUSH  40.13,21.84 0 top
RT  99.11,46.99 180 top
SJ1  68.12,21.34 180 top
U1  59.69,55.88 0 top
U$1  6.65,38.1 270 top
U$2  76.7,48.26 225 top
U$3  64.05,48.51 0 top
U$4  95.04,53.09 0 top
U$5  45.51,52.32 0 top
U$6  49.07,52.32 0 top
U$7  38.15,52.32 0 top
U$8  41.96,52.32 0 top
U$9  30.53,52.32 0 top
U$10  34.59,52.32 0 top
U$11  22.91,52.32 0 top
U$12  26.46,52.32 0 top
U$13  60.19,6.3 0 top
VCC!  8.99,20.68 90 top

### Tracks (layer width: path | path; a pad name or v marks a point on that pad's centre or on a via)
3.3V
  Top 0.254: 71.16,54.16 C9.1 | U$2.16 73.96,52.77 73.96,58.16 | U$2.18 72.11,53.21
  Top 0.305: 79.26,52.58 U$2.9 | LCD_CONN.P4 84.96,48.34
  Top 0.406: 84.96,48.34 86.41,49.78 87.17,49.78 87.42,50.04 87.42,52.58 85.64,54.36 | R10.2 81.16,59.18 79.55,59.18 79.04,58.67 79.04,57.4 78.02,56.39 75.73,56.39 73.96,58.16 73.83,58.29
  Top 0.508: 79.26,52.58 81.58,52.58 82.34,53.34 84.88,53.34 85.64,54.1 85.64,54.36 85.64,56.39 84.12,57.91 R10.2 | U1.14 70.65,59.69 C9.1 71.92,60.2 73.83,58.29
  Top 0.61: C14.1 62.95,44.54 61.77,45.72 61.77,49.28 62.31,49.81 U$3.5 64.47,51.18 65.96,51.18 66.59,50.55 68.37,50.55 71.04,53.21 | 71.04,53.21 71.16,53.33 C9.1 | 72.11,53.21 71.04,53.21
12V  (via drill 0.5, 0.6)
  Top 0.305: U$4.2 92.77,49.03 92.25,48.51 91.74,48.51 90.23,50.03
  Top 0.508: 90.23,50.03 88.76,48.56 BL_L1.1
  Top 0.61: BL_L1.1 88.73,47.24 v89.96,47.24 | 25.68,6.62 v25.7,6.6 24.47,5.37 CANPWR.2 10.17,5.37 3.86,11.68 D2.A
  Top 0.635: CIN.1 CIN1.1 CIN2.1 CIN3.1 90.23,50.03
  Bottom 0.61: v89.96,47.24 49.32,6.6 v25.7,6.6
12V_PROTECTED  (via drill 0.38, 0.6)
  Top 0.61: v13.25,45.97 9.7,45.97 C15.1 9.45,44.71 6.65,41.91 2.33,41.91 1.57,41.15 1.57,36.35 2.6,35.32 | v52.37,50.29 51.34,51.32 U$6.P$3 | U$8.P$3 42.91,50.99 v41.96,50.04 | U$12.P$3 27.41,49.72 v26.72,49.02 | U$10.P$3 35.54,50.23 v34.84,49.53 | D2.C 1.57,26.79 1.57,34.29 2.6,35.32 | 2.6,35.32 U$1.3
  Bottom 0.61: v13.25,45.97 16.3,49.02 v26.72,49.02 27.22,49.53 v34.84,49.53 35.35,50.04 v41.96,50.04 42.21,50.29 v52.37,50.29
AVR_CS  (via drill 0.6)
  Top 0.406: U1.2 55.93,58.42 54.66,57.15 v54.66,56.39 | v55.16,38.1 53.96,39.3 IC1.10
  Bottom 0.406: v54.66,56.39 55.16,55.88 v55.16,38.1
AVR_MISO
  Top 0.305: U1.6 57.96,53.34 59.23,52.07 59.23,45.21 55.72,41.7 IC1.13
AVR_MOSI
  Top 0.305: U1.12 61.01,57.15 60.5,56.64 60.5,53.59 59.99,53.09 59.99,44.96 55.93,40.9 IC1.12
AVR_SCLK
  Top 0.305: U1.9 61.51,53.34 60.75,52.58 60.75,44.7 56.15,40.1 IC1.11
  Top 0.508: 56.15,40.1 56.69,39.56 56.69,28.19 58.97,25.91 58.97,22.61 59.65,21.93 H7.3
B2
  Top 0.254: U$2.35 74.98,43.34 74.98,40.89 75.46,40.41 LCD_CONN.P23
B3
  Top 0.254: U$2.34 74.47,43.55 74.47,40.64 74.95,40.16 LCD_CONN.P24
B4
  Top 0.254: U$2.33 73.96,43.76 73.96,40.39 74.44,39.9 LCD_CONN.P25
B5
  Top 0.254: U$2.32 73.45,43.93 73.45,40.13 73.96,39.62 LCD_CONN.P26
B6
  Top 0.254: U$2.31 72.94,44.14 72.94,39.88 73.45,39.37 LCD_CONN.P27
B7
  Top 0.254: U$2.30 72.44,44.35 72.44,39.62 72.94,39.12 LCD_CONN.P28
BACKLIGHT_CTRL  (via drill 0.6)
  Top 0.305: U$4.15 95.37,56.83 v94.79,57.4 | v70.4,48.26 70.4,49.28 70.66,49.53 71.55,49.53 U$2.24
  Bottom 0.254: 74.98,43.69 77.77,43.69 82.85,48.77 86.66,48.77 89.45,51.56 89.45,52.32
  Bottom 0.305: v94.79,57.4 91.74,57.4 89.45,55.12 89.45,52.32 | 74.98,43.69 v70.4,48.26
BL_ANODE
  Top 0.254: 86.91,40.39 85.95,39.42 LCD_CONN.P2
  Top 0.305: COUT.1 88.83,40.78 88.44,40.39 86.91,40.39 | U$4.5 94.72,48.08 95.8,46.99
  Top 0.508: RFB1.2 CFB.1 RT.2 95.8,46.99 95.04,46.23 BL_D1.C 95.55,44.7 96.82,43.43 96.82,41.91 96.06,41.15 91.23,41.15 90.47,41.91 COUT.1
BL_CATHODE
  Top 0.254: 87.17,39.62 86.46,38.91 LCD_CONN.P1
  Top 0.305: U$4.10 97.97,49.65 98.09,49.53 101.39,49.53
  Top 0.406: 101.39,49.53 103.93,46.99 103.93,41.66 102.66,40.39 89.45,40.39 88.69,39.62 87.17,39.62
CAN_H
  Top 0.254: IC2.7 24.81,16.64 24.18,16 23.92,16 23.16,15.24 23.16,14.63 IC3.2
  Top 0.305: CANPWR.4 10.21,7.87 9.19,8.89 9.19,15.24 10.21,16.26 17.06,16.26 18.59,14.73 20.62,14.73 21.82,13.53 IC3.2
CAN_L
  Top 0.254: IC2.6 23.54,16.38 22.59,15.43 IC3.1
  Top 0.305: CANPWR.3 10.44,6.62 8.43,8.64 8.43,15.49 9.95,17.02 17.32,17.02 18.91,15.43 IC3.1
DATA_EN
  Top 0.254: U$2.25 69.95,45.38 LCD_CONN.P34
DCLK
  Top 0.254: U$2.29 71.95,44.59 LCD_CONN.P30
DISP_EN
  Top 0.254: U$2.28 71.44,44.76 LCD_CONN.P31
DRV1
  Top 0.508: F5.2 30.91,64.14 33.07,66.29 38.15,66.29 40.94,63.5 40.94,61.27 LEDOUT.2
DRV2
  Top 0.508: F4.2 32.94,59.05 36.62,62.74 39.16,62.74 39.67,62.23 LEDOUT.3
DRV3
  Top 0.508: LEDOUT.4 38.42,60.3 40.3,58.42 F3.2
FT801_CS_N  (via drill 0.6)
  Top 0.254: 81.83,51.82 80.62,51.82 U$2.6 | U1.3 57.79,57.78 63.42,57.78 65.58,55.63 v68.63,55.63
  Top 0.305: v83.1,52.32 82.34,52.32 81.83,51.82
  Bottom 0.305: v68.63,55.63 79.8,55.63 v83.1,52.32
FT801_MISO  (via drill 0.5, 0.6)
  Top 0.254: v84.63,50.8 83.87,50.04 82.34,50.04 81.56,50.82 81.02,50.82 U$2.4
  Top 0.406: U1.5 v59.23,54.61
  Bottom 0.305: 60.75,53.09 79.29,53.09 82.34,50.04 83.87,50.04 v84.63,50.8
  Bottom 0.406: v59.23,54.61 60.75,53.09
FT801_MOSI  (via drill 0.5)
  Top 0.254: U$2.5 80.83,51.31 82.6,51.31 v82.85,51.05
  Top 0.305: U1.11 64.05,55.88 65.58,54.36 v67.1,54.36
  Bottom 0.305: v67.1,54.36 79.55,54.36 v82.85,51.05
FT801_SCLK  (via drill 0.5)
  Top 0.254: U$2.3 81.09,50.16 81.45,50.16 81.58,50.04
  Top 0.305: U1.8 v67.1,52.07 | v86.41,50.8 85.14,49.53 82.09,49.53 81.58,50.04
  Bottom 0.305: v67.1,52.07 79.29,52.07 82.09,49.28 84.88,49.28 v86.41,50.8
G2
  Top 0.254: U$2.42 80.46,44.15 80.46,39.89 79.45,38.88 LCD_CONN.P15
G3
  Top 0.254: U$2.41 79.97,43.92 79.97,40.11 78.96,39.11 LCD_CONN.P16
G4
  Top 0.254: U$2.40 79.47,43.73 79.47,40.31 78.46,39.29 LCD_CONN.P17
G5
  Top 0.254: U$2.39 78.9,43.58 78.9,40.76 77.95,39.8 LCD_CONN.P18
G6
  Top 0.254: U$2.38 78.4,43.36 78.4,42.55 77.46,41.6 LCD_CONN.P19
G7
  Top 0.254: U$2.37 77.77,43.31 77.77,42.67 76.96,41.86 LCD_CONN.P20
GND  (via drill 0.38, 0.5, 0.6)
  Top 0.254: U$2.10 77.1,51.13 U$2.V_7 76.31,51.13 U$2.15 74.72,52.72 74.72,53.09 | U$2.V_1 79.9,48.26 U$2.2 | U$2.V_9 73.51,48.26 U$2.23 | LCD_CONN.P22 75.94,36.78 75.74,36.58 | LCD_CONN.P21 76.45,36.88 76.75,36.58 | LCD_CONN.P29 72.46,36.8 72.69,36.58 | LCD_CONN.P36 68.96,36.75 69.13,36.58 | LCD_CONN.P6 83.94,36.65 83.87,36.58 | LCD_CONN.P5 84.45,36.75 84.63,36.58 | LCD_CONN.P3 85.44,36.78 85.64,36.58 | LCD_CONN.P14 79.95,36.73 79.8,36.58
  Top 0.406: U1.13 59.99,58.42 58.72,59.69 U1.1
  other vias: 102.66,45.21 102.66,46.48 24.18,52.58 32.3,52.83 39.67,52.58 46.78,52.58 53.13,27.18 53.13,25.91 54.4,25.91 37.89,58.67 83.87,56.64 84.63,55.37 91.99,44.45 91.99,42.93 75.99,42.16 58.72,40.64 58.72,38.86 60.5,40.64 62.02,40.64
  pour Bottom (rank 6): 0,0 105.41,0 105.41,67.31 0,67.31
  pour Top: 63.5,40.64 90.17,40.64 90.17,29.21 63.5,29.21
  pour Top (rank 6): 0,0 105.41,0 105.41,67.31 0,67.31
HSYNC
  Top 0.254: U$2.27 70.96,45 LCD_CONN.P32
INT_N  (via drill 0.38, 0.6)
  Top 0.254: U$2.11 79.6,54.36 v83.87,54.36 | v55.16,36.07 54.15,37.08 54.15,38.1 53.75,38.5 IC1.9
  Bottom 0.254: v55.16,36.07 56.69,37.59 56.69,55.37 58.72,57.4 80.82,57.4 v83.87,54.36
N$2
  Top 0.254: U$2.17 73.06,52.98 C8.1
N$3
  Top 0.254: C7.1 79.94,55.37 U$2.12
  Top 0.305: R10.1 C7.1
N$4
  Top 0.305: 92.77,58.77 U$4.19
  Top 0.508: CVCC.1 RCOMM.2 92.77,58.77
N$5
  Top 0.305: RCOMM.1 96.67,57.14 U$4.13
N$6
  Top 0.508: IC2.8 27.64,18.01 R3.1
N$7  (via drill 0.6)
  Top 0.305: CDHC.1 80.73,61.38 v81.83,62.48 | v99.11,58.67 97.97,57.53 U$4.11
  Bottom 0.305: v81.83,62.48 95.3,62.48 v99.11,58.67
N$8
  Top 0.305: 93.42,48.62 U$4.3 U$4.4 94.07,47.28
  Top 0.508: 95.38,42.33 BL_D1.A 94.37,42.33 93.52,43.18 93.52,46.74 94.07,47.28 | BL_L1.2 89.92,44.41 93.42,47.91 93.42,48.62
N$9
  Top 0.508: R6.1 10.04,23.45 VCC!.A
N$10
  Top 0.305: U$4.7 96.02,49.06 96.31,48.77 100.88,48.77
  Top 0.508: RFB2.2 101.81,42.42 RFB1.1 CFB.2 100.88,44.7 101.65,45.47 101.65,48.01 100.88,48.77
N$11
  Top 0.254: 34.34,43.69 37.51,46.86 45.26,46.86 45.66,46.46 IC1.24
  Top 0.305: C1.2 33.13,36.39 34.34,37.59 34.34,43.69
  Top 0.508: C1.2 31.22,35.05 Q1.1
N$12
  Top 0.305: U$4.6 95.37,48.7 96.06,48.01 99.61,48.01
  Top 0.508: 99.61,48.01 99.96,47.66 RT.1
N$14
  Top 0.305: RIREF.1 97.32,58.85 U$4.12
N$22
  Top 0.508: L1.2 51.26,26.04 IC1.64
N$23
  Top 0.406: 45.26,54.61 44.5,53.85
  Top 0.508: R5.2 46.36,55.46 45.51,54.61 45.26,54.61 | 44.5,53.85 44.5,51.39
  Top 0.559: 44.5,51.39 U$5.P$2
N$24
  Top 0.559: R4.2 49.92,55.46 49.07,54.61 48.56,54.61 48.05,54.1 48.05,51.39 U$6.P$2
N$25
  Top 0.559: R4.1 48.22,55.79 45.75,53.32 U$5.P$1
N$26
  Top 0.559: F2.1 50.98,54.74 49.56,53.32 U$6.P$1
N$27
  Top 0.508: 38.15,54.61 37.64,54.61 37.13,54.1 37.13,51.39
  Top 0.559: R12.2 38.74,55.21 38.15,54.61 | 37.13,51.39 U$7.P$2
N$28
  Top 0.559: R11.2 42.3,55.21 41.7,54.61 41.45,54.61 40.69,53.85 40.69,51.64 U$8.P$2
N$29
  Top 0.559: R11.1 40.6,55.28 38.64,53.32 U$7.P$1
N$30
  Top 0.508: 43.48,58.29 43.48,54.86 42.97,54.36 42.97,54.34 U$8.P$1
  Top 0.559: 43.48,58.29 F3.1
N$31
  Top 0.508: 30.87,55.21 30.02,54.36 29.76,54.36 29.51,54.1 29.51,51.39 U$9.P$2
  Top 0.559: R14.2 30.87,55.21
N$33
  Top 0.508: R13.2 34.68,55.46 33.64,54.42 U$10.P$2
N$37
  Top 0.559: R13.1 32.98,55.28 31.02,53.32 U$9.P$1
N$38
  Top 0.508: U$10.P$1 34.59,53.85 35.73,54.99 F4.1
N$39
  Top 0.508: R16.2 23.5,55.21 22.91,54.61 22.14,54.61 21.89,54.36 21.89,51.39 U$11.P$2
N$40
  Top 0.559: R15.2 27.06,55.21 26.46,54.61 25.95,54.61 25.45,54.1 25.45,51.39 U$12.P$2
N$41
  Top 0.559: U$11.P$1 23.4,53.32 25.36,55.28 R15.1
N$42
  Top 0.508: U$12.P$1 26.46,53.34 28.11,54.99 F5.1
PB4(PWM)
  Top 0.254: R5.1 44.24,55.46 44.24,54.61 43.73,54.1 43.73,50.29 44.5,49.53 51.35,49.53 55.16,45.72 55.16,43.43 54.23,42.5 IC1.14
PB5(PWM)
  Top 0.254: R12.1 36.37,55.21 36.37,49.78 37.13,49.02 51.1,49.02 54.66,45.47 54.66,43.94 54.01,43.3 IC1.15
PB6(PWM)
  Top 0.254: R14.1 29,55.71 29,54.86 28.49,54.36 28.49,50.04 30.02,48.51 50.85,48.51 54.15,45.21 54.15,44.7 53.54,44.1 IC1.16
PB7(PWM)
  Top 0.254: R16.1 20.62,54.7 20.62,50.8 23.41,48.01 50.08,48.01 51.26,46.83 IC1.17
PC0  (via drill 0.5)
  Top 0.305: IC1.35 36.45,42.5 35.86,41.91 v35.86,31.5 | v36.37,23.88 36.38,23.86 ROT/PUSH.1
  Bottom 0.305: v35.86,31.5 36.37,30.99 v36.37,23.88
PF0
  Top 0.508: ROT/PUSH.5 41.38,22.54 42.97,24.13 47.29,24.13 48.86,25.7 IC1.61
PF1
  Top 0.508: ROT/PUSH.3 38.88,22.32 41.7,25.15 47.04,25.15 48.06,26.17 IC1.60
PF2
  Top 0.508: ROT/PUSH.2 37.63,22.6 41.07,26.04 46.66,26.04 47.26,26.64 IC1.59
PF3
  Top 0.508: CANPWR.6 25.66,10.37 31.8,16.51 31.8,21.59 35.61,25.4 38.91,25.4 40.39,26.88 45.72,26.88 46.46,27.62 IC1.58
PF4
  Top 0.508: CANPWR.7 25.39,11.62 30.78,17.02 30.78,22.1 35.1,26.42 38.4,26.42 39.67,27.69 44.5,27.69 45.66,28.85 IC1.57
R2
  Top 0.254: U$2.48 83.46,45.38 LCD_CONN.P7
R3
  Top 0.254: U$2.47 82.95,45.21 LCD_CONN.P8
R4
  Top 0.254: U$2.46 82.44,45 LCD_CONN.P9
R5
  Top 0.254: U$2.45 81.96,44.76 LCD_CONN.P10
R6
  Top 0.254: U$2.44 81.45,44.59 LCD_CONN.P11
R7
  Top 0.254: U$2.43 80.94,44.38 LCD_CONN.P12
RESET  (via drill 0.5)
  Top 0.508: C16.1 65.77,24.06 R1.1 SJ1.2 67.67,19.06 D1.A | 65.64,24.07 C16.1 | v59.23,28.7 61.32,26.61 H7.5 61.66,24.13 C16.1 | v48.81,42.67 48.86,42.72 IC1.20
  Bottom 0.508: v59.23,28.7 56.69,28.7 48.81,36.58 v48.81,42.67
RX
  Top 0.508: 56.12,21.53 H7.4 56.02,21.93 56.94,22.86 56.94,25.4 54.66,27.69 54.66,32.26 54.01,32.9 IC1.2
RXCAN  (via drill 0.5)
  Top 0.305: IC1.31 39.92,45.73 v39.92,42.67 | v18.84,24.89 19.58,24.16 IC2.4
  Bottom 0.305: v39.92,42.67 39.92,38.61 27.73,26.42 20.11,26.42 18.84,25.15 v18.84,24.89
TX
  Top 0.508: IC1.3 54.48,33.7 55.67,32.51 55.67,27.94 57.96,25.65 57.96,20.57 59.14,19.39 H7.1
TXCAN  (via drill 0.5)
  Top 0.305: IC1.30 40.94,45.78 v40.94,41.15 | v29.76,25.15 27.07,25.15 IC2.1
  Bottom 0.305: v40.94,41.15 40.94,38.61 29.76,27.43 v29.76,25.15
VCC  (via drill 0.6)
  Top 0.406: IC1.21 48.06,44.2 v47.04,43.18
  Top 0.508: 64.15,18.89 63.04,17.78 56.84,17.78 H7.2 53.04,19.39 51.1,21.34 L1.1 50.87,23.11 | v37.64,28.45 41.19,28.45 41.66,28.91 IC1.52
  Top 0.559: R1.2 63.87,19.17 64.15,18.89 D1.C | v37.64,28.45 25.7,28.45 23.54,26.29 | 50.87,23.11 v48.31,23.11 43.48,23.11 42.72,22.35 42.72,21.13 ROT/PUSH.6
  Top 0.61: U$1.2 3.99,38.1 U$1.4 | U$1.4 9.83,37.82 | U$3.1 63.1,48.33 63.29,48.51 64.56,48.51 65,48.07 U$3.3 65,45.87 C13.1 67.27,44.54 68.12,43.69 68.12,41.4 65.58,38.86 64.05,38.86 62.28,37.08 62.28,29.46 64.56,27.18 69.13,27.18 71.42,24.89 71.42,17.78 69.39,15.75 65.07,15.75 63.04,17.78 | 23.54,26.29 IC2.3 | U$1.4 9.55,36.18 C3.1 3.85,29.4 7.35,25.9 R6.2 6.07,22.95 6.07,15.57 v6.9,14.73 | v14.78,9.14 14.76,9.12 CANPWR.5 | U$1.4 16.05,38.1 25.7,28.45
  Bottom 0.406: v47.04,43.18 47.04,34.54 40.94,28.45 v37.64,28.45
  Bottom 0.508: v6.9,14.73 10.46,14.73 14.78,10.41 v14.78,9.14
  Bottom 0.559: v37.64,28.45 44.24,28.45 48.31,24.38 v48.31,23.11
VSYNC
  Top 0.254: U$2.26 70.45,45.21 LCD_CONN.P33
XTAL1
  Top 0.254: C2.2 33.25,43.37 37.38,47.5 45.77,47.5 46.46,46.81 IC1.23
  Top 0.508: C2.2 31.22,44.7 Q1.2

### Text on the board
tPlace: C:/Users/Nick Mah/Downloads/logo-blue.bmp | Schematic By: Thomas Willson / Layout By: Andrew Ferguson